# EasyEDA Pro project tachyon.eprj, board IO
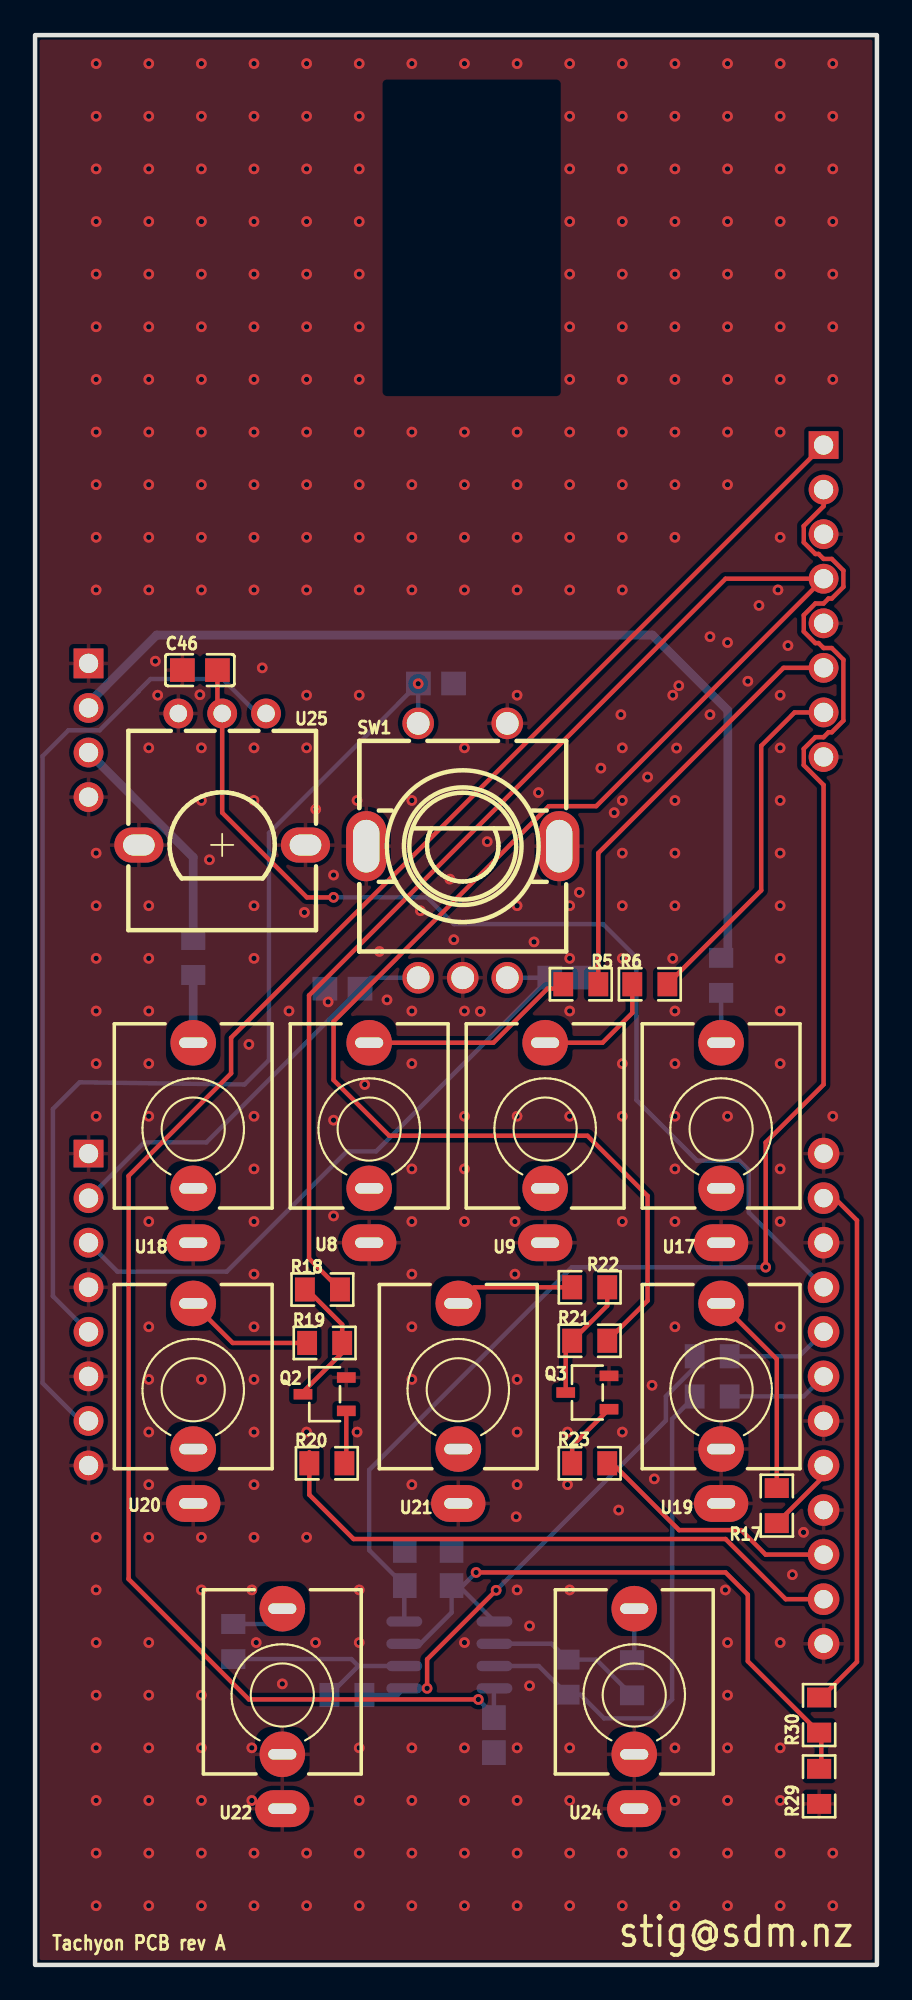
[diagram p6: board, top side]
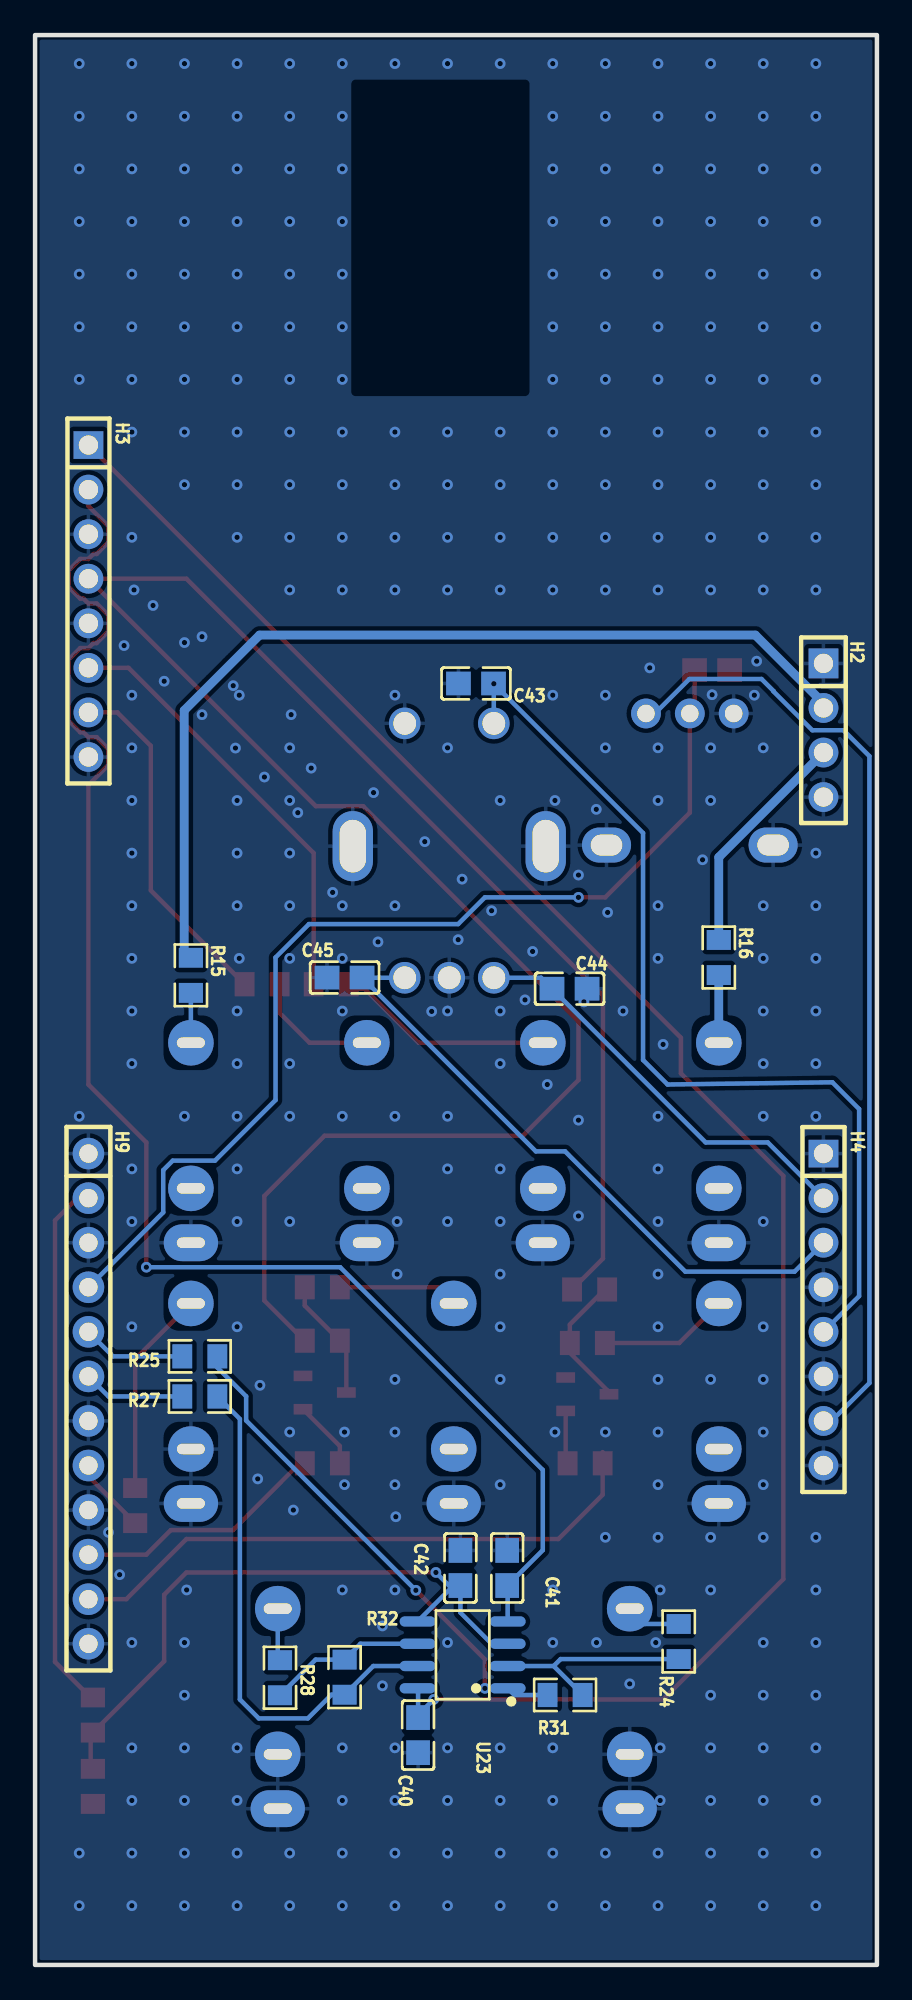
[diagram p7: board, bottom side, seen from below]

Outline 48 x 110 mm; copper layers: Top Layer, GND, GND2, Bottom Layer. Coordinates in mm from the lower left corner of the outline.
Outline path: rectangle 0,110 48,0
Stack: Top Layer 0.035mm Outer layer thickness 1oz / Dielectric1 0.2104mm 7628 RC49% 8.6mil / GND 0.0152mm Inner layer thickness / Dielectric2 1.065mm 1.1mm H/HOZ Copper / GND2 0.0152mm Inner layer thickness / Dielectric3 0.2104mm 7628 RC49% 8.6mil / Bottom Layer 0.035mm Outer layer thickness 1oz

## Design rules (mm)
template: JLCPCB Capability(Two Layers Board)
spacing copperThickness1oz (default): track to track 0.102, other pairs 0.152 to 0.3
spacing copperThickness2oz: track to track 0.203, other pairs 0.152 to 0.3
track width copperThickness1oz (default): min 0.127, default 0.254, max 2.54
track width copperThickness2oz: min 0.203, default 0.254, max 2.54
differential pair differentialPair (default): width min 0.127, default 0.254, max 2.54; gap min 0.152, default 0.152
via viaSize (default): diameter min 0.5, default 0.61, max 10; hole min 0.3, default 0.305, max 6.3

## Placement (name value [footprint] x y rotation side)
C40  100nF  [C0805]  26.16 13.1 270 bottom
C41  100nF  [C0805]  21.08 22.62 90 bottom
C42  2.2nF  [C0805]  23.75 22.62 270 bottom
C43  10nF  [C0805]  22.86 73.04 0 bottom
C44  10nF  [C0805]  17.53 55.64 180 bottom
C45  10nF  [C0805]  30.35 56.28 0 bottom
C46  100nF  [C0805]  9.4 73.81 0 top
H2  2.54-1*4P母  [HDR-TH_4P-P2.54-V-F]  3.05 70.38 270 bottom
H3  PM2.54-1X8PM-H85  [HDR-TH_8P-P2.54-V-F]  44.96 77.74 270 bottom
H4  PM2.54-1X8PM-H85  [HDR-TH_8P-P2.54-V-F]  3.05 37.36 270 bottom
H9  BX-PM2.54-1-12PY  [HDR-TH_12P-P2.54-V-F]  44.96 32.28 270 bottom
Q2  2N7002K-T1-GE3  [SOT-23-3_L2.9-W1.6-P1.90-LS2.8-BR]  16.51 32.53 0 top
Q3  2N7002K-T1-GE3  [SOT-23-3_L2.9-W1.6-P1.90-LS2.8-BR]  31.49 32.63 0 top
R5  1kΩ  [R0805]  31.11 55.9 180 top
R6  1kΩ  [R0805]  35.05 55.9 180 top
R15  1kΩ  [R0805]  39.12 56.41 270 bottom
R16  1kΩ  [R0805]  9.02 57.42 270 bottom
R17  1kΩ  [R0805]  42.29 26.18 90 top
R18  10kΩ  [R0805]  16.38 38.5 0 top
R19  1kΩ  [R0805]  16.51 35.45 180 top
R20  1kΩ  [R0805]  16.64 28.59 0 top
R21  10kΩ  [R0805]  31.62 35.58 0 top
R22  1kΩ  [R0805]  31.62 38.63 180 top
R23  1kΩ  [R0805]  31.62 28.59 180 top
R24  100kΩ  [R0805]  11.3 18.43 90 bottom
R25  1kΩ  [R0805]  38.61 34.69 180 bottom
R27  1kΩ  [R0805]  38.61 32.4 180 bottom
R28  100kΩ  [R0805]  34.04 16.37 90 bottom
R29  10kΩ  [R0805]  44.7 10.18 90 top
R30  10kΩ  [R0805]  44.7 14.24 90 top
R31  33kΩ  [R0805]  17.78 15.39 0 bottom
R32  33kΩ  [R0805]  30.35 16.4 270 bottom
SW1  USR-ENC  [SW-TH_EC11XXXXXXXX]  24.38 63.52 0 top
U8  CV-OUT-A  [Jack_3.5mm_QingPu_WQP-PJ301M-12_Vertical]  19.05 47.64 0 top
U9  CV-OUT-B  [Jack_3.5mm_QingPu_WQP-PJ301M-12_Vertical]  29.08 47.64 0 top
U17  A-OUT-R  [Jack_3.5mm_QingPu_WQP-PJ301M-12_Vertical]  39.12 47.64 0 top
U18  A-OUT-L  [Jack_3.5mm_QingPu_WQP-PJ301M-12_Vertical]  9.02 47.64 0 top
U19  CLK-IN  [Jack_3.5mm_QingPu_WQP-PJ301M-12_Vertical]  39.12 32.78 0 top
U20  GATE-OUT-A  [Jack_3.5mm_QingPu_WQP-PJ301M-12_Vertical]  9.02 32.78 0 top
U21  GATE-OUT-B  [Jack_3.5mm_QingPu_WQP-PJ301M-12_Vertical]  24.13 32.78 0 top
U22  CV-IN-A  [Jack_3.5mm_QingPu_WQP-PJ301M-12_Vertical]  14.1 15.39 0 top
U23  OPA1642AIDR  [SOIC-8_L4.9-W3.9-P1.27-LS6.0-BL]  23.62 17.67 90 bottom
U24  CV-IN-B  [Jack_3.5mm_QingPu_WQP-PJ301M-12_Vertical]  34.16 15.39 0 top
U25  10kΩ  [RES-ADJ-TH_RK09L1140A65]  10.67 67.58 180 top

## Footprints (pads in the part's own frame, mm; a bottom-side part is the same pattern mirrored in y, then rotated)
C0805
  rect 1.41x1.35 smd: 1(-1,0) 2(1,0)
HDR-TH_4P-P2.54-V-F
  rect 1.7x1.7 hole 1.1: 1(-3.81,0)
  round 1.7 hole 1.1: 2(-1.27,0) 3(1.27,0) 4(3.81,0)
HDR-TH_8P-P2.54-V-F
  rect 1.575x1.7 hole 1.1: 1(-8.89,0)
  round 1.7 hole 1.1: 2(-6.35,0) 3(-3.81,0) 4(-1.27,0) 5(1.27,0) 6(3.81,0) 7(6.35,0) 8(8.89,0)
HDR-TH_12P-P2.54-V-F
  round 1.8 hole 1.05: 1(-13.97,0) 2(-11.43,0) 3(-8.89,0) 4(-6.35,0) 5(-3.81,0) 6(-1.27,0) 7(1.27,0) 8(3.81,0) 9(6.35,0) 10(8.89,0) 11(11.43,0) 12(13.97,0)
Jack_3.5mm_QingPu_WQP-PJ301M-12_Vertical
  oval 3.1x2.1 hole 1.6x0.6: S(0,-6.48)
  rrect 2.6x2.6 hole 1.6x0.6: T(0,4.92) TN(0,-3.38)
R0805
  rect 1.133x1.377 smd: 1(-1,0) 2(1,0)
RES-ADJ-TH_RK09L1140A65
  round 1.7 hole 1: 1(-2.5,-3.75) 2(0,-3.75) 3(2.5,-3.75)
  oval 2.8x2 hole 1.8x1.2: 4(-4.75,3.75) 4(4.75,3.75)
SOIC-8_L4.9-W3.9-P1.27-LS6.0-BL
  oval 0.588x2.045 smd: 1(-1.905,-2.57) 2(-0.635,-2.57) 3(0.635,-2.57) 4(1.905,-2.57) 5(1.905,2.57) 6(0.635,2.57) 7(-0.635,2.57) 8(-1.905,2.57)
SOT-23-3_L2.9-W1.6-P1.90-LS2.8-BR
  rect 1.07x0.6 smd: 1(1.235,-0.95) 2(1.235,0.95) 3(-1.235,0)
SW-TH_EC11XXXXXXXX
  oval 2.3x4 hole 1.5x3: 6(5.5,0.25) 7(-5.5,0.25)
  round 1.8 hole 1.3: A(-2.54,-7.25) B(2.54,-7.25) C(0,-7.25) D(-2.54,7.25) E(2.54,7.25)

## Nets
As in the schematic, except:
GND: C40.2 C41.2 C42.1 C43.2 C44.2 C45.2 C46.1 H2.1 H2.4 H3.3 H3.5 H3.8 H4.1 H4.4 H4.6 H4.8 H9.1 H9.3 H9.7 H9.9 H9.12 Q2.2 Q3.2 R29.1 SW1.6 SW1.7 SW1.C SW1.E U8.S U9.S U17.S U18.S U19.S U19.TN U20.S U21.S U22.S U22.TN U24.S U24.TN U25.3 U25.4
CV-OUT-A: H3.6 R5.1
CV-OUT-B: H3.7 R6.1
$3N352: R6.2 U9.T
$3N353: R5.2 U8.T

Pads without a net: U8 TN; U9 TN; U17 TN; U18 TN; U20 TN; U21 TN

## Via types
v1: diameter 0.61, hole 0.305, Top Layer to Bottom Layer, 368 vias

## Routing (per net, layer and track width the routed paths; a pad name or vN(x,y) marks a point on that pad's centre or on a via; arc(x,y) is an arc through that point)
+3V3: length 54.8
  Bottom Layer w0.254: H4.7 2.59,31.01 0.43,33.17 0.43,68.9 1.91,70.38 3.68,70.38 5.9,72.59 5.9,72.62 6.58,73.3 10.7,73.3 13.17,70.82
+5V: length 128.3
  Top Layer w0.254: R21.2 32.64,35.58 34.92,37.86 34.92,43.83 31.5,47.26 20.19,47.26 17.02,50.44 17.02,53.77 29.29,66.05 31.99,66.05 H3.4 39.37,79.01 15.62,55.26 15.62,40.26 R18.2
+12V: length 106.8
  Top Layer w0.254: H3.1 11.18,52.85 11.18,50.82 5.33,44.98 5.33,21.99 12.19,15.13 v1(25.27,15.13)
  Bottom Layer w0.254: U23.8 26.16,15.74 26.16,14.24 ; 26.16,14.24 v1(25.27,15.13) ; 26.16,14.24 C40.1
-12V: length 88.8
  Top Layer w0.254: H3.2 44.96,83.15 43.83,82.02 43.83,81.08 44.49,80.42 44.68,80.42 44.96,80.14 45.43,80.14 46.09,79.48 46.09,78.54 45.43,77.88 45.24,77.88 44.96,77.6 44.49,77.6 43.83,76.94 43.83,76 44.49,75.34 44.68,75.34 44.96,75.06 45.43,75.06 46.09,74.4 46.09,70.92 45.43,70.26 45.24,70.26 44.96,69.98 44.49,69.98 43.83,69.32 43.83,68.38 44.96,67.26 44.96,50.18 41.66,46.88 v1(41.66,39.77)
  Bottom Layer w0.254: U23.4 21.05,21.59 C41.1 21.07,21.62 19.05,23.64 19.05,28.21 30.61,39.77 v1(41.66,39.77)
GND:
  vias: v1(3.48,108.37) v1(3.48,105.37) v1(3.48,102.37) v1(3.48,99.37) v1(3.48,96.37) v1(3.48,93.37) v1(3.48,90.37) v1(3.48,87.37) v1(3.48,84.37) v1(3.48,81.37) v1(3.48,78.37) v1(3.48,63.37) v1(3.48,60.37) v1(3.48,57.37) v1(3.48,54.37) v1(3.48,51.37) v1(3.48,48.37) v1(3.48,24.37) v1(3.48,21.37) v1(3.48,18.37) v1(3.48,15.37) v1(3.48,12.37) v1(3.48,9.37) v1(3.48,6.37) v1(3.48,3.37) v1(6.48,108.37) v1(6.48,105.37) v1(6.48,102.37) v1(6.48,99.37) v1(6.48,96.37) v1(6.48,93.37) v1(6.48,90.37) v1(6.48,87.37) v1(6.48,84.37) v1(6.48,81.37) v1(6.48,78.37) v1(6.48,69.37) v1(6.48,60.37) v1(6.48,57.37) v1(6.48,54.37) v1(6.48,51.37) v1(6.48,48.37) v1(6.48,42.37) v1(6.48,36.37) v1(6.48,33.37) v1(6.48,30.37) v1(6.48,27.37) v1(6.48,24.37) v1(6.48,18.37) v1(6.48,15.37) v1(6.48,12.37) v1(6.48,9.37) v1(6.48,6.37) v1(6.48,3.37) v1(6.86,74.31) v1(6.99,72.37) v1(9.4,72.4) v1(9.48,108.37) v1(9.48,105.37) v1(9.48,102.37) v1(9.48,99.37) v1(9.48,96.37) v1(9.48,93.37) v1(9.48,90.37) v1(9.48,87.37) v1(9.48,84.37) v1(9.48,81.37) v1(9.48,78.37) v1(9.48,69.37) v1(9.48,66.37) v1(9.48,33.37) v1(9.48,24.37) v1(9.48,21.37) v1(9.48,15.37) v1(9.48,12.37) v1(9.48,9.37) v1(9.48,6.37) v1(9.48,3.37) v1(9.94,62.99) v1(12.19,52.47) v1(12.36,21.37) v1(12.36,12.37) v1(12.36,9.37) v1(12.48,108.37) v1(12.48,105.37) v1(12.48,102.37) v1(12.48,99.37) v1(12.48,96.37) v1(12.48,93.37) v1(12.48,90.37) v1(12.48,87.37) v1(12.48,84.37) v1(12.48,81.37) v1(12.48,78.37) v1(12.48,69.37) v1(12.48,66.37) v1(12.48,60.37) v1(12.48,57.37) v1(12.48,48.37) v1(12.48,45.37) v1(12.48,42.37) v1(12.48,39.37) v1(12.48,36.37) v1(12.48,33.37) v1(12.48,30.37) v1(12.48,27.37) v1(12.48,24.37) v1(12.48,6.37) v1(12.48,3.37) v1(12.61,18.37) v1(12.95,73.93) v1(14.1,16.02) v1(14.48,54.37) v1(15.36,59.99) v1(15.48,108.37) v1(15.48,105.37) v1(15.48,102.37) v1(15.48,99.37) v1(15.48,96.37) v1(15.48,93.37) v1(15.48,90.37) v1(15.48,87.37) v1(15.48,84.37) v1(15.48,81.37) v1(15.48,78.37) v1(15.48,72.37) v1(15.48,69.37) v1(15.48,30.37) v1(15.48,24.37) v1(15.48,6.37) v1(15.48,3.37) v1(16,65.87) v1(15.99,18.37) v1(16.71,54.89) v1(17.02,62.12) v1(17.02,48.15) v1(17.02,42.69) v1(18.36,66.37) v1(18.36,30.37) v1(18.48,108.37) v1(18.48,105.37) v1(18.48,102.37) v1(18.48,99.37) v1(18.48,96.37) v1(18.48,93.37) v1(18.48,90.37) v1(18.48,87.37) v1(18.48,84.37) v1(18.48,81.37) v1(18.48,78.37) v1(18.48,72.37) v1(18.48,21.37) v1(18.48,18.37) v1(18.48,12.37) v1(18.48,9.37) v1(18.48,6.37) v1(18.48,3.37) v1(18.8,50.18) v1(19.63,57.77) v1(20.07,55.01) v1(21.48,108.37) v1(21.48,87.37) v1(21.48,84.37) v1(21.48,81.37) v1(21.48,78.37) v1(21.48,66.37) v1(21.48,54.37) v1(21.48,51.37) v1(21.48,45.37) v1(21.48,42.37) v1(21.48,39.37) v1(21.48,36.37) v1(21.48,33.37) v1(21.48,27.37) v1(21.48,12.37) v1(21.48,9.37) v1(21.48,6.37) v1(21.48,3.37) v1(21.97,60.09) v1(23.65,61.89) v1(23.88,58.44) v1(24.48,108.37) v1(24.48,87.37) v1(24.48,84.37) v1(24.48,81.37) v1(24.48,78.37) v1(24.48,69.37) v1(24.48,54.37) v1(24.48,48.37) v1(24.48,45.37) v1(24.48,42.37) v1(24.48,18.37) v1(24.48,12.37) v1(24.48,9.37) v1(24.48,6.37) v1(24.48,3.37) v1(25.39,54.35) v1(25.78,64.03) v1(27.36,42.37) v1(27.36,39.37) v1(27.43,25.55) v1(27.48,108.37) v1(27.48,87.37) v1(27.48,84.37) v1(27.48,81.37) v1(27.48,78.37) v1(27.48,72.37) v1(27.48,60.37) v1(27.48,48.37) v1(27.48,33.37) v1(27.48,30.37) v1(27.48,27.37) v1(27.48,21.37) v1(27.48,12.37) v1(27.48,9.37) v1(27.48,6.37) v1(27.48,3.37) v1(28.19,19.32) v1(28.19,15.91) v1(28.45,58.31) v1(28.7,66.82) v1(30.36,30.37) v1(30.36,27.37) v1(30.48,108.37) v1(30.48,105.37) v1(30.48,102.37) v1(30.48,99.37) v1(30.48,96.37) v1(30.48,93.37) v1(30.48,90.37) v1(30.48,87.37) v1(30.48,84.37) v1(30.48,81.37) v1(30.48,78.37) v1(30.48,60.37) v1(30.48,57.37) v1(30.48,54.37) v1(30.48,48.37) v1(30.48,21.37) v1(30.48,12.37) v1(30.48,9.37) v1(30.48,6.37) v1(30.48,3.37) v1(31.03,61.13) v1(32.26,68.22) v1(33.02,65.68) v1(33.27,25.93) v1(33.4,71.27) v1(33.48,108.37) v1(33.48,105.37) v1(33.48,102.37) v1(33.48,99.37) v1(33.48,96.37) v1(33.48,93.37) v1(33.48,90.37) v1(33.48,87.37) v1(33.48,84.37) v1(33.48,81.37) v1(33.48,78.37) v1(33.48,69.37) v1(33.48,66.37) v1(33.48,63.37) v1(33.48,60.37) v1(33.48,57.37) v1(33.48,51.37) v1(33.48,48.37) v1(33.48,42.37) v1(33.48,30.37) v1(33.48,6.37) v1(33.48,3.37) v1(34.92,67.71) v1(35.18,33.04) v1(35.31,27.7) v1(36.36,72.37) v1(36.36,57.37) v1(36.48,108.37) v1(36.48,105.37) v1(36.48,102.37) v1(36.48,99.37) v1(36.48,96.37) v1(36.48,93.37) v1(36.48,90.37) v1(36.48,87.37) v1(36.48,84.37) v1(36.48,81.37) v1(36.58,69.36) v1(36.48,66.37) v1(36.48,63.37) v1(36.48,60.37) v1(36.48,54.37) v1(36.48,51.37) v1(36.48,48.37) v1(36.48,45.37) v1(36.48,42.37) v1(36.48,36.37) v1(36.48,12.37) v1(36.48,9.37) v1(36.48,6.37) v1(36.48,3.37) v1(36.7,72.92) v1(38.48,75.71) v1(38.48,71.27) v1(39.36,21.37) v1(39.48,108.37) v1(39.48,105.37) v1(39.48,102.37) v1(39.48,99.37) v1(39.48,96.37) v1(39.48,93.37) v1(39.48,90.37) v1(39.48,87.37) v1(39.48,84.37) v1(39.48,75.37) v1(39.48,48.37) v1(39.48,18.37) v1(39.48,15.37) v1(39.48,12.37) v1(39.48,9.37) v1(39.48,6.37) v1(39.48,3.37) v1(40.64,73.17) v1(41.27,77.49) v1(42.36,78.37) v1(42.48,108.37) v1(42.48,105.37) v1(42.48,102.37) v1(42.48,99.37) v1(42.48,96.37) v1(42.48,93.37) v1(42.48,90.37) v1(42.48,87.37) v1(42.48,81.37) v1(42.48,72.37) v1(42.48,69.37) v1(42.48,66.37) v1(42.48,63.37) v1(42.48,60.37) v1(42.48,57.37) v1(42.48,54.37) v1(42.48,51.37) v1(42.48,45.37) v1(42.48,42.37) v1(42.48,36.37) v1(42.48,18.37) v1(42.48,12.37) v1(42.48,9.37) v1(42.48,6.37) v1(42.48,3.37) v1(42.93,75.2) v1(43.18,22.24) v1(43.82,24.66) v1(45.48,108.37) v1(45.48,105.37) v1(45.48,102.37) v1(45.48,99.37) v1(45.48,96.37) v1(45.48,93.37) v1(45.48,90.37) v1(45.48,48.37) v1(45.48,6.37) v1(45.48,3.37)
A-OUT-L: length 13.2
  Bottom Layer w0.5: H2.3 9.02,63.14 R16.1
A-OUT-R: length 54.4
  Bottom Layer w0.5: R15.1 39.5,57.79 39.5,71.5 35.2,75.8 6.93,75.8 3.05,71.92 H2.2
CLK-IN: length 4.4
  Top Layer w0.254: H9.8 44.96,27.85 R17.1
CV-IN-A: length 5.9
  Bottom Layer w0.254: R25.1 43.56,34.69 H9.5
CV-IN-B: length 5.8
  Bottom Layer w0.254: H9.6 43.82,32.4 R27.1
CV-OUT-A: length 24.7
  Top Layer w0.254: R5.1 32.11,63.38 42.67,73.93 H3.6
CV-OUT-B: length 20.2
  Top Layer w0.254: R6.1 41.4,61.25 41.4,69.49 43.31,71.39 H3.7
GATE-OUT-A: length 34.2
  Top Layer w0.254: H9.11 42.8,20.85 39.37,24.28 18.16,24.28 15.64,26.8 15.64,29.23
GATE-OUT-B: length 14.5
  Top Layer w0.254: R23.1 32.72,28.49 33.01,28.49 36.72,24.78 40.26,24.78 41.66,23.39 H9.10
USR-ENC-A: length 24
  Bottom Layer w0.254: SW1.A 19.15,56.27 C44.1 9.76,46.88 6.22,46.88 H4.2
USR-ENC-B: length 36.3
  Bottom Layer w0.254: H4.3 4.7,39.52 10.92,39.52 17.78,46.37 19.45,46.37 C45.1 ; 29.22,56.27 SW1.B ; 29.35,56.41 29.29,56.34
USR-ENC-SW: length 54.3
  Top Layer w0.254: v1(21.84,73.03) C43.1
  Bottom Layer w0.254: H4.5 1.02,38.12 1.02,48.79 2.54,50.31 11.94,50.18 13.33,51.58 13.33,64.52 v1(21.84,73.03) SW1.D
USR-POT-1: length 59.7
  Top Layer w0.254: 10.4,73.55 10.4,71.09 10.67,70.82 10.67,65.68 15.49,60.85 v1(17.02,60.85)
  Bottom Layer w0.254: v1(17.02,60.85) 22.35,60.85 23.88,59.33 32.39,59.33 34.29,57.42 34.29,49.29 37.74,45.84 40.15,45.84 40.7,45.3 40.7,42.89 H9.4
VREF: length 30.5
  Top Layer w0.254: 44.83,15.24 46.86,17.27 46.86,42.44 45.59,43.71 44.96,43.71
$3N352: length 7.3
  Top Layer w0.254: U9.T 32.35,52.56 34.05,54.26 R6.2
$3N353: length 12.4
  Top Layer w0.254: R5.2 29.86,55.64 29.21,55.64 26.13,52.56 U8.T
$3N5741: length 2.8
  Bottom Layer w0.254: R15.2 U17.T
$3N5746: length 3.9
  Bottom Layer w0.5: R16.2 U18.T
$3N6968: length 11.8
  Top Layer w0.254: U19.T 42.29,34.53 R17.2
$3N7465: length 7.8
  Top Layer w0.254: 15.38,38.63 17.51,36.5 17.51,34.89 15.27,32.66
$3N7646: length 7.4
  Top Layer w0.254: U20.T 11.27,35.45 R19.2
$3N7687: length 3
  Top Layer w0.254: 17.74,31.71 17.74,28.83 17.64,28.72
$3N7930: length 7
  Top Layer w0.254: Q3.3 30.25,35.21 R21.1 32.62,37.58 R22.1
$3N7933: length 4
  Top Layer w0.254: R23.2 30.62,29.58 32.72,31.68
$3N7937: length 6.9
  Top Layer w0.254: R22.2 25.05,38.63 U21.T
$3N9421: length 3.2
  Bottom Layer w0.254: R24.2 13.23,19.43 U22.T
$3N9619: length 12.2
  Bottom Layer w0.254: R24.1 18.03,17.43 18.43,17.04 ; 18.43,17.04 U23.2 ; 18.43,17.04 R31.1
$3N9658: length 29
  Top Layer w0.254: v1(22.35,15.77) 22.35,17.42 v1(26.29,21.35)
  Bottom Layer w0.254: R25.2 37.61,34.05 35.97,32.41 35.97,31.03 v1(26.29,21.35) ; R31.2 20.67,15.39 U23.1 v1(22.35,15.77)
$3N11411: length 2.9
  Bottom Layer w0.254: U24.T 34.16,17.37
$3N11416: length 9.1
  Bottom Layer w0.254: U23.6 29.45,18.31 R32.1 32,17.4 R28.1
$3N11459: length 37.2
  Top Layer w0.254: R30.1 40.64,17.31 40.64,21.1 39.37,22.37 v1(25.15,22.37) ; 44.83,11.18 44.83,13.24
  Bottom Layer w0.254: v1(25.15,22.37) 24.4,21.62 24.14,21.62 ; U23.5 24.14,21.62 ; 24.14,21.62 C42.2 23.75,20.08 21.97,18.31 U23.3
$3N12731: length 29.6
  Bottom Layer w0.254: U23.7 28.72,17.04 R32.2 31.1,15.4 32.45,14.05 35.24,14.05 36.32,15.13 36.32,31.12 R27.2

## Copper pours and planes (outline as drawn; the poured copper is in the pictures)
GND on Top Layer: 0.25,109.75 47.75,109.75 47.75,0.27 0.25,0.27
GND on Bottom Layer: 0.25,109.75 47.75,109.75 47.75,0.27 0.25,0.27
GND on GND: 0.26,109.74 47.74,109.74 47.74,0.26 0.26,0.26
GND on GND2: 0.26,109.74 47.74,109.74 47.74,0.26 0.26,0.26

Small or netless copper shapes (teardrops, artwork), in the pictures only: 132 on GND, 132 on GND2

## Text on the board
Top Silkscreen Layer: Tachyon PCB rev A | stig@sdm.nz
